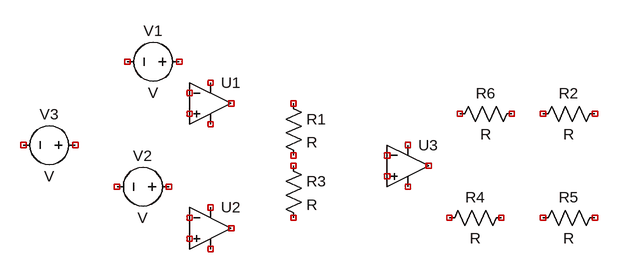
[diagram p0: schematic ia_amp_v1.asc]
ia_amp_v1.asc, the LTspice schematic file:
Version 4
SHEET 1 880 680
SYMBOL OpAmps\\UniversalOpAmp2 32 272 R0
SYMATTR InstName U1
SYMBOL OpAmps\\UniversalOpAmp2 32 464 R0
SYMATTR InstName U2
SYMBOL OpAmps\\UniversalOpAmp2 336 368 R0
SYMATTR InstName U3
SYMBOL res 144 256 R0
SYMATTR InstName R1
SYMBOL res 640 272 R90
WINDOW 0 0 56 VBottom 2
WINDOW 3 32 56 VTop 2
SYMATTR InstName R2
SYMBOL res 144 352 R0
SYMATTR InstName R3
SYMBOL res 496 432 R90
WINDOW 0 0 56 VBottom 2
WINDOW 3 32 56 VTop 2
SYMATTR InstName R4
SYMBOL res 640 432 R90
WINDOW 0 0 56 VBottom 2
WINDOW 3 32 56 VTop 2
SYMATTR InstName R5
SYMBOL res 512 272 R90
WINDOW 0 0 56 VBottom 2
WINDOW 3 32 56 VTop 2
SYMATTR InstName R6
SYMBOL voltage 0 208 R90
WINDOW 0 -32 56 VBottom 2
WINDOW 3 32 56 VTop 2
SYMATTR InstName V1
SYMBOL voltage -16 400 R90
WINDOW 0 -32 56 VBottom 2
WINDOW 3 32 56 VTop 2
SYMATTR InstName V2
SYMBOL voltage -160 336 R90
WINDOW 0 -32 56 VBottom 2
WINDOW 3 32 56 VTop 2
SYMATTR InstName V3

The netlist it stands for:
* ia_amp_v1.asc
XU1 NC_01 NC_02 NC_03 NC_04 NC_05 level2 Avol=1Meg GBW=10Meg Slew=10Meg Ilimit=25m Rail=0 Vos=0 En=0 Enk=0 In=0 Ink=0 Rin=500Meg  ; pins In+ In- V+ V- OUT
XU2 NC_06 NC_07 NC_08 NC_09 NC_10 level2 Avol=1Meg GBW=10Meg Slew=10Meg Ilimit=25m Rail=0 Vos=0 En=0 Enk=0 In=0 Ink=0 Rin=500Meg  ; pins In+ In- V+ V- OUT
XU3 NC_11 NC_12 NC_13 NC_14 NC_15 level2 Avol=1Meg GBW=10Meg Slew=10Meg Ilimit=25m Rail=0 Vos=0 En=0 Enk=0 In=0 Ink=0 Rin=500Meg  ; pins In+ In- V+ V- OUT
R1 NC_16 NC_17 R
R2 NC_18 NC_19 R
R3 NC_20 NC_21 R
R4 NC_22 NC_23 R
R5 NC_24 NC_25 R
R6 NC_26 NC_27 R
V1 NC_28 NC_29 V
V2 NC_30 NC_31 V
V3 NC_32 NC_33 V
.lib UniversalOpAmp2.lib
.backanno
.end